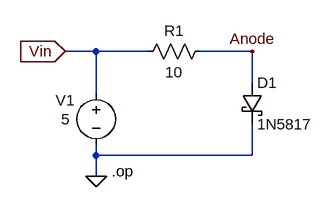
[diagram p0: schematic Vol Src with Series Res to Drive Schottky Diode.asc]
Vol Src with Series Res to Drive Schottky Diode.asc, the LTspice schematic file:
Version 4
SHEET 1 880 680
WIRE 112 96 64 96
WIRE 192 96 112 96
WIRE 352 96 272 96
WIRE 352 144 352 96
WIRE 112 160 112 96
WIRE 112 256 112 240
WIRE 352 256 352 208
WIRE 352 256 112 256
WIRE 112 288 112 256
FLAG 112 288 0
FLAG 64 96 Vin
IOPIN 64 96 In
FLAG 352 96 Anode
SYMBOL voltage 112 144 R0
WINDOW 0 -62 27 Left 2
WINDOW 3 -54 56 Left 2
WINDOW 123 0 0 Left 0
WINDOW 39 0 0 Left 0
SYMATTR InstName V1
SYMATTR Value 5
SYMBOL res 288 80 R90
WINDOW 0 0 56 VBottom 2
WINDOW 3 32 56 VTop 2
SYMATTR InstName R1
SYMATTR Value 10
SYMBOL schottky 336 144 R0
SYMATTR InstName D1
SYMATTR Value 1N5817
SYMATTR Description Diode
SYMATTR Type diode
TEXT 136 280 Left 2 !.op

The netlist it stands for:
* Vol Src with Series Res to Drive Schottky Diode.asc
V1 Vin 0 5
R1 Anode Vin 10
D1 Anode 0 1N5817
.model D D
.lib standard.dio
.op
.backanno
.end